# EAGLE design red-cluster (EAGLE 7.6.0)
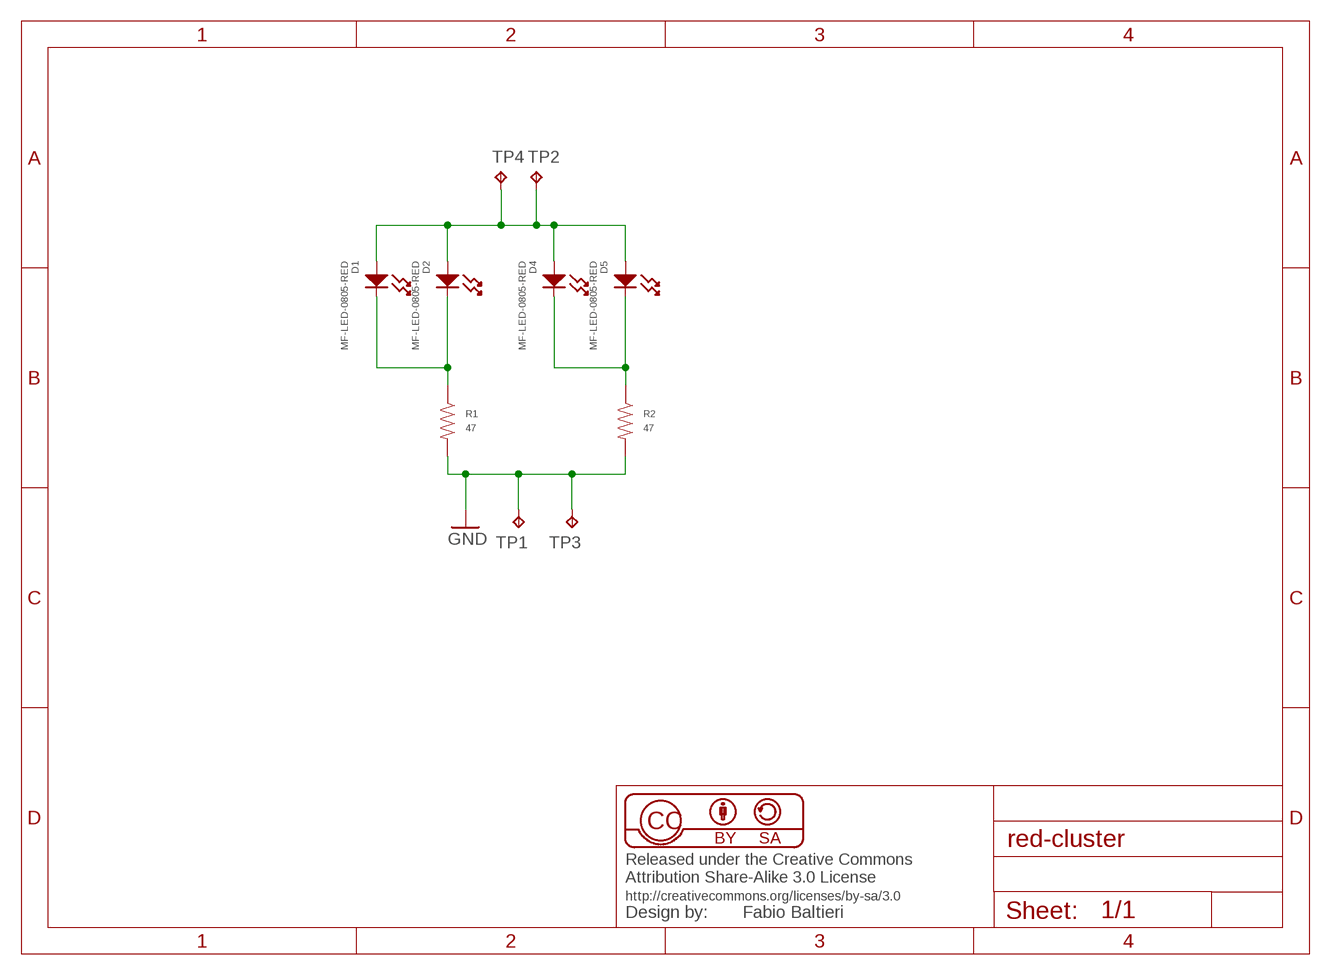
[diagram p0: schematic, sheet 1]

## Parts
D1  MF-LED-0805-RED  LED_SINGLE-0805-RED  [LED0805]
D2  MF-LED-0805-RED  LED_SINGLE-0805-RED  [LED0805]
D4  MF-LED-0805-RED  LED_SINGLE-0805-RED  [LED0805]
D5  MF-LED-0805-RED  LED_SINGLE-0805-RED  [LED0805]
R1  47  RESISTOR_0805  [R0805]
R2  47  RESISTOR_0805  [R0805]
TP1  TPTP15R  [TP15R]
TP2  TPTP15R  [TP15R]
TP3  TPTP15R  [TP15R]
TP4  TPTP15R  [TP15R]

## Nets
GND: R1.P$2 R2.P$2 TP1.TP TP3.TP
N$1: D1.CATHODE D2.CATHODE R1.P$1
N$2: D4.CATHODE D5.CATHODE R2.P$1
N$4: D1.ANODE D2.ANODE D4.ANODE D5.ANODE TP2.TP TP4.TP

## Library data of the parts
D1 D2 D4 D5 = MF_LEDs:LED_SINGLE: Library: MF_LEDs Description: Device for Single LED Packages. Manufacture part number (MFG#) can be added via Attributes.; HOUSEPART: YES; MPN: MF-LED-0805-RED; POPULATE: 1; URL: https://factory.macrofab.com/part/MF-LED-0805-RED
R1 R2 = MF_Passives:RESISTOR: Library: MF_Passives Description: Device for Resistors. Manufacture part number (MPN), Voltage, Tolerance, and Wattage Rating can be added via Attributes. Check https://factory.macrofab.com/parts for the house parts list.; POPULATE: 1
TP1-TP4 = testpad:TP: Test pad

## Board
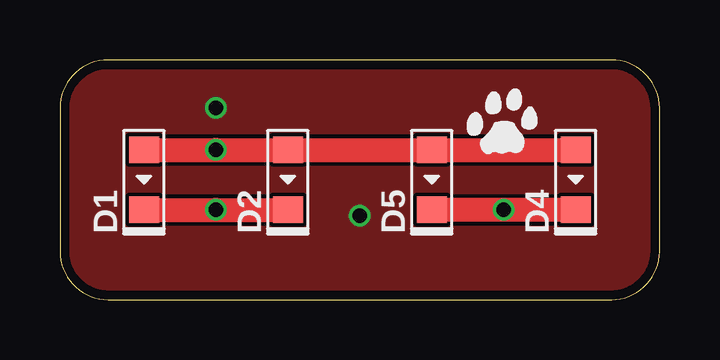
[diagram p1: board, top side]
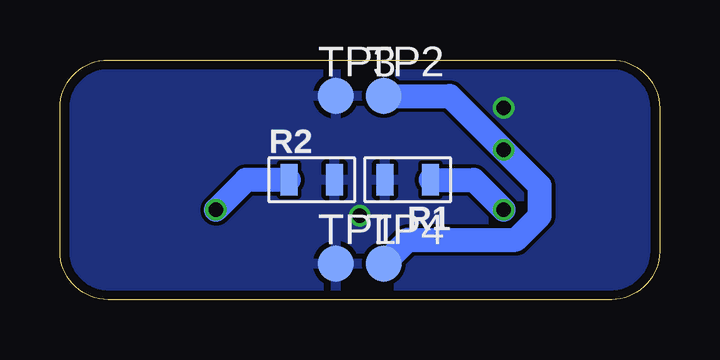
[diagram p2: board, bottom side, seen from below]

Size 25 x 10 mm. Coordinates in mm from the lower left corner, seen from the top.
Outline: 0,8 0,2 arc90 2,0 23,0 arc90 25,2 25,8 arc90 23,10 2,10 arc90 0,8
Copper layers (1*16): Top 0.035mm / dielectric 1.5mm / Bottom 0.035mm
Design rules "balto": minimum track width 6mil, minimum drill 13mil, track to track 6mil, track to pad 6mil, pad to pad 6mil, via to via 6mil, smd to smd 6mil, copper to edge 15mil, drill to drill 6mil, minimum pad ring 6mil, minimum via ring 6mil, stop-mask expansion 2mil, vias tented up to drill 20mil, thermal gap 8mil

### Footprints (pad centres in the part's own frame; a part is rotated, then mirrored left to right if it is on the bottom)
LED0805 = smd 1.1 x 1.25: ANODE 1.25,0; CATHODE -1.25,0
R0805 = smd 0.7 x 1.3: P$1 -0.95,0; P$2 0.95,0
TP15R = smd 1.5 x 1.5: TP 0,0

### Placement (x,y rotation side)
D1  3.5,5 90 top
D2  9.5,5 90 top
D4  21.5,5 90 top
D5  15.5,5 90 top
R1  10.5,5 180 bottom
R2  14.5,5 0 bottom
TP1  13.5,1.5 0 bottom
TP2  11.5,8.5 0 bottom
TP3  13.5,8.5 0 bottom
TP4  11.5,1.5 0 bottom
U$1  [CAT-L]  18.5,7 0 top

### Tracks (layer width: path | path; a pad name or v marks a point on that pad's centre or on a via)
GND  (via drill 0.6)
  other vias: 6.5,8 12.5,3.5
  pour Bottom: -1,-1 26,-1 26,11 -1,11
  pour Top: -0.5,-0.5 25.5,-0.5 25.5,10.5 -0.5,10.5
N$1  (via drill 0.6)
  Top 1: D1.CATHODE v6.5,3.75 D2.CATHODE
  Bottom 1: R1.P$1 7.75,5 v6.5,3.75
N$2  (via drill 0.6)
  Top 1: D4.CATHODE v18.5,3.75 D5.CATHODE
  Bottom 1: R2.P$1 17.25,5 v18.5,3.75
N$4  (via drill 0.6)
  Top 1: D1.ANODE v6.5,6.25 D2.ANODE D5.ANODE D4.ANODE
  Bottom 1: TP2.TP 8.75,8.5 v6.5,6.25 5,4.75 5,3.5 6,2.5 10.5,2.5 TP4.TP